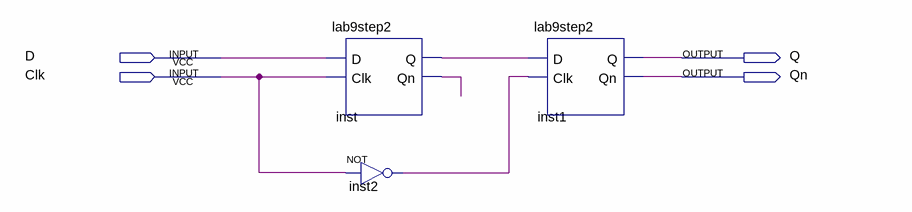
[diagram p0: schematic sheet]
// Quartus schematic lab9step3.bdf as structural Verilog: 3 symbols, 4 pins
module lab9step3 (
  input  D,
  input  Clk,
  output Q,
  output Qn
);

  wire inst2_out, inst_q, inst_qn;

  lab9step2 inst (.D(D), .Clk(Clk), .Q(inst_q), .Qn(inst_qn));
  not inst2 (inst2_out, Clk);
  lab9step2 inst1 (.D(inst_q), .Clk(inst2_out), .Q(Q), .Qn(Qn));
endmodule
